# Altium schematic sheet MicroController.SchDoc
size A3; Revision: V1.0; SheetNumber: 2; SheetTotal: 3
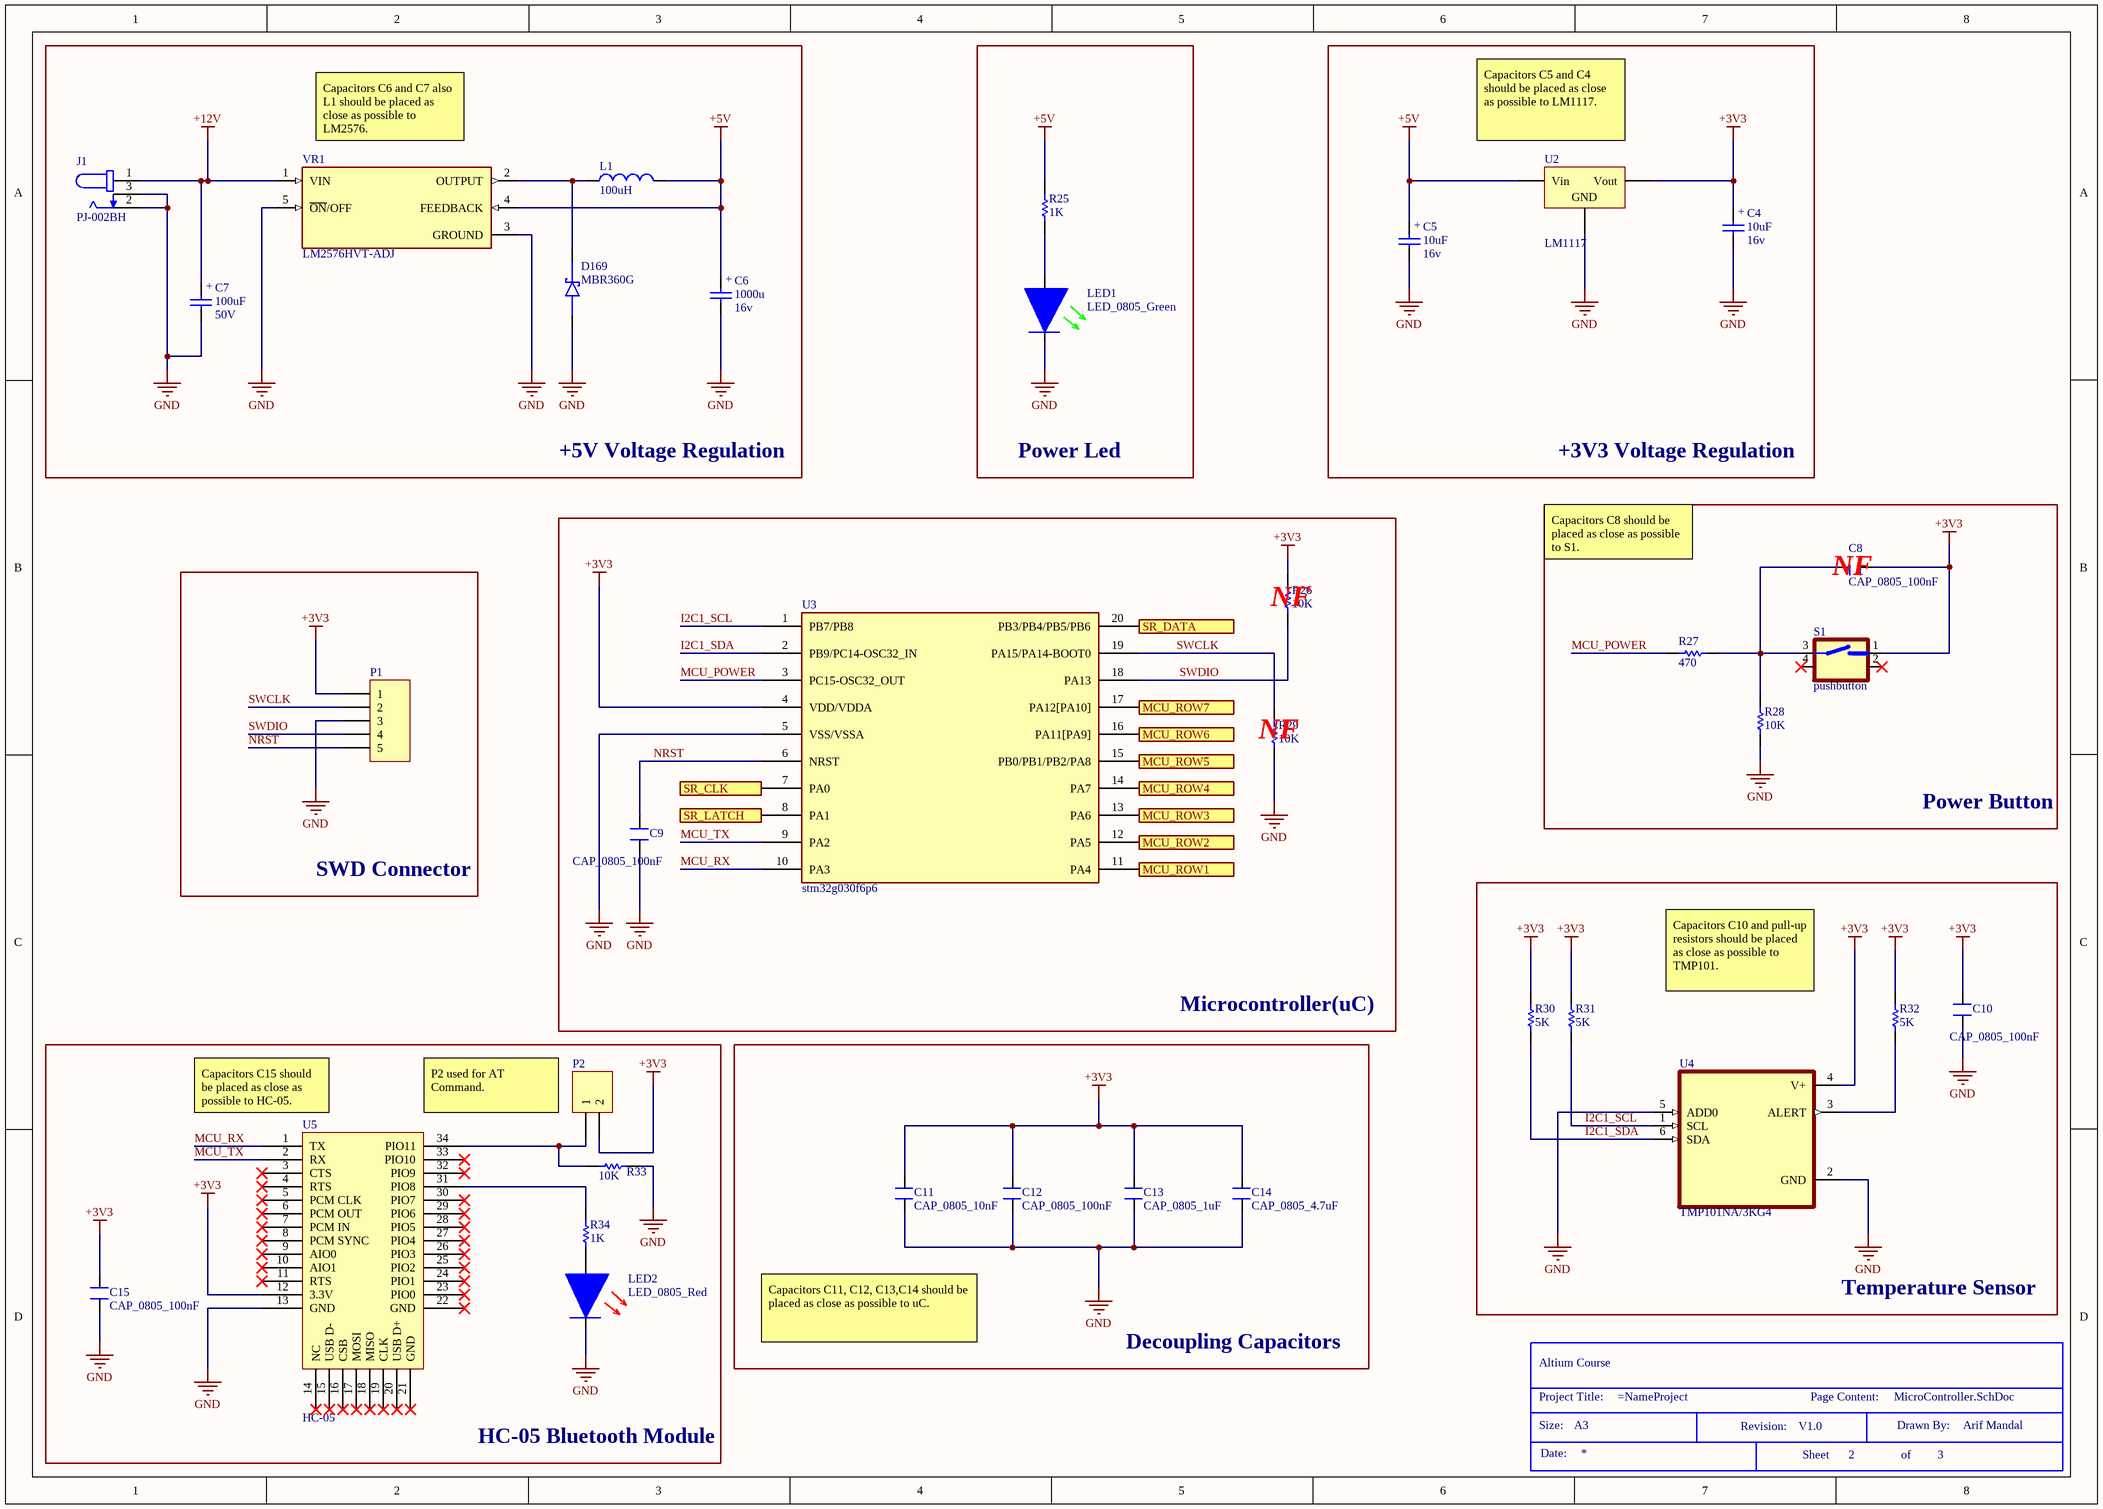
[diagram p0: MicroController.SchDoc]

## Parts
*  Size: A3  Drawn By: Arif Mandal  (hidden comment: Title Block)  (graphical)
C4  Volte: 16v  [MY_SMC_B]  (hidden comment: 10uF)
C5  Volte: 16v  [MY_SMC_B]  (hidden comment: 10uF)
C6  Volte: 16v  [MY_CLV_0810]  (hidden comment: 1000u)
C7  Volte: 50V  [MY_CLV_0810]  (hidden comment: 100uF)
C8  CAP_0805_100nF  [CAP_0805]
C9  CAP_0805_100nF  [CAP_0805]
C10  CAP_0805_100nF  [CAP_0805]
C11  CAP_0805_10nF  [CAP_0805]
C12  CAP_0805_100nF  [CAP_0805]
C13  CAP_0805_1uF  [CAP_0805]
C14  CAP_0805_4.7uF  [CAP_0805]
C15  CAP_0805_100nF  [CAP_0805]
D169  MBR360G  [DIOAD950W125L840D505]
J1  PJ-002BH  [CUI_PJ-002BH]
L1  100uH  [MY_DR125]
LED1  LED_0805_Green  [LED_0805]
LED2  LED_0805_Red  [LED_0805]
P1  Header 5  [My_1X05]  (value not drawn)
P2  Header 2  [My_1X02]  (value not drawn)
R25  1K  [MY_0805]
R26  10K  [MY_0805]
R27  470  [MY_0805]
R28  10K  [MY_0805]
R29  10K  [MY_0805]
R30  5K  [MY_0805]
R31  5K  [MY_0805]
R32  5K  [MY_0805]
R33  10K  [MY_0805]
R34  1K  [MY_0805]
S1  pushbutton  [button]
U2  LM1117  [MY_SOT223]
U3  stm32g030f6p6  [TSSOP20]
U4  TMP101NA/3KG4  [SOT95P280X145-6N]
U5  HC-05  [HC-05]
VR1  LM2576HVT-ADJ  [TO170P1067X483X1651-5]

## Blocks framed on the sheet
+5V Voltage Regulation: C6 C7 D169 J1 L1 VR1
Power Led: LED1 R25
+3V3 Voltage Regulation: C4 C5 U2
NF: C8 R27 R28 S1
SWD Connector: P1
Temperature Sensor: C10 R30-R32 U4
HC-05 Bluetooth Module: C15 LED2 P2 R33 R34 U5
Decoupling Capacitors: C11-C14

## Ports
MCU_ROW1 (out), MCU_ROW2 (out), MCU_ROW3 (out), MCU_ROW4 (out), MCU_ROW5 (out), MCU_ROW6 (out), MCU_ROW7 (out), SR_CLK (out), SR_DATA (out), SR_LATCH (out)

## Nets
+3V3: C4.+ C8.2 C10.2 C11.2 C12.2 C13.2 C14.2 C15.2 P1.1 P2.2 R26.1 R30.1 R31.1 R32.1 S1.1 U2.2(Vout) U3.4(VDD/VDDA) U4.4(V+) U5.12(3.3V)
+5V: C5.+ C6.+ L1.2 R25.2 U2.3(Vin) VR1.4(FEEDBACK)
+12V: C7.+ J1.1 VR1.1(VIN)
GND: C4.- C5.- C6.- C7.- C9.1 C10.1 C11.1 C12.1 C13.1 C14.1 C15.1 D169.A J1.2 J1.3 LED1.C LED2.C P1.3 R28.2 R29.2 R33.1 U2.1(GND) U3.5(VSS/VSSA) U4.2(GND) U4.5(ADD0) U5.13(GND) VR1.3(GROUND) VR1.5(~{ON}/OFF)
I2C1_SCL: R31.2 U3.1(PB7/PB8) U4.1(SCL)
I2C1_SDA: R30.2 U3.2(PB9/PC14-OSC32_IN) U4.6(SDA)
MCU_POWER: R27.1 U3.3(PC15-OSC32_OUT)
MCU_ROW1: U3.11(PA4) ; port MCU_ROW1
MCU_ROW2: U3.12(PA5) ; port MCU_ROW2
MCU_ROW3: U3.13(PA6) ; port MCU_ROW3
MCU_ROW4: U3.14(PA7) ; port MCU_ROW4
MCU_ROW5: U3.15(PB0/PB1/PB2/PA8) ; port MCU_ROW5
MCU_ROW6: U3.16(PA11[PA9]) ; port MCU_ROW6
MCU_ROW7: U3.17(PA12[PA10]) ; port MCU_ROW7
MCU_RX: U3.10(PA3) U5.1(TX)
MCU_TX: U3.9(PA2) U5.2(RX)
NRST: C9.2 P1.5 U3.6(NRST)
SR_CLK: U3.7(PA0) ; port SR_CLK
SR_DATA: U3.20(PB3/PB4/PB5/PB6) ; port SR_DATA
SR_LATCH: U3.8(PA1) ; port SR_LATCH
SWCLK: P1.2 R29.1 U3.19(PA15/PA14-BOOT0)
SWDIO: P1.4 R26.2 U3.18(PA13)
NetC8_1: C8.1 R27.2 R28.1 S1.3
NetD169_C: D169.C L1.1 VR1.2(OUTPUT)
NetLED1_A: LED1.A R25.1
NetLED2_A: LED2.A R34.1
NetP2_1: P2.1 R33.2 U5.34(PIO11)
NetR32_2: R32.2 U4.3(ALERT)
NetR34_2: R34.2 U5.31(PIO8)

Not connected (* = marked no-connect by the designer): S1 2* 4(1)*; U5 3(CTS)* 4(RTS)* 5(PCM_CLK)* 6(PCM_OUT)* 7(PCM_IN)* 8(PCM_SYNC)* 9(AIO0)* 10(AIO1)* 11(RTS)* 14(NC)* 15(USB_D-)* 16(CSB)* 17(MOSI)* 18(MISO)* 19(CLK)* 20(USB_D+)* 21(GND)* 22(GND)* 23(PIO0)* 24(PIO1)* 25(PIO2)* 26(PIO3)* 27(PIO4)* 28(PIO5)* 29(PIO6)* 30(PIO7)* 32(PIO9)* 33(PIO10)*

## Notes on the sheet
- (near VR1) Capacitors C6 and C7 also L1 should be placed as close as possible to LM2576.
- (near U2) Capacitors C5 and C4 should be placed as close as possible to LM1117.
- Capacitors C8 should be placed as close as possible to S1.
- (near R26) NF
- (near R29) NF
- Power Button
- Capacitors C10 and pull-up resistors should be placed as close as possible to TMP101.
- Microcontroller(uC)
- (near U5) Capacitors C15 should be placed as close as possible to HC-05.
- P2 used for AT Command.
- Capacitors C11, C12, C13,C14 should be placed as close as possible to uC.
- (in symbol Title Block) Altium Course; Project Title:; Page Content:; Size:; Revision:; Drawn By:; Date:; Sheet; of

## Library data of the parts
C4-C7 = Cap Pol: Polar capacitor; ASiD Part Number: C-AS
  C4 C5: Value: 10uF
  C6: Value: 1000u
  C7: Value: 100uF
C8-C10 C12 C15 = CAP_0805_100nF: 0805 100nF 16VDC ±10% X7R; Voltage Rating: 16V; Tolerance: %10; Package Size: 0805; Manufacturer: https://ozdisan.com/pasif-komponentler/kapasitorler/smt-smd-ve-mlcc-kapasitorler/CC0805KRX7R7BB104/748339; Dielectric: X7R
C11 = CAP_0805_10nF: 0805 10nF 16VDC ±10% X7R; Voltage Rating: 16V; Tolerance: %10; Package Size: 0805; Manufacturer: https://ozdisan.com/pasif-komponentler/kapasitorler/smt-smd-ve-mlcc-kapasitorler/CL21B105KOFNNNE/29632; Dielectric: X7R
C13 = CAP_0805_1uF: 0805 1uF 16VDC ±10% X7R; Voltage Rating: 16V; Tolerance: %10; Package Size: 0805; Manufacturer: https://ozdisan.com/pasif-komponentler/kapasitorler/smt-smd-ve-mlcc-kapasitorler/CL21B105KOFNNNE/29632; Dielectric: X7R
C14 = CAP_0805_4.7uF: 0805 4.7uF 16VDC ±10% X7R; Voltage Rating: 16V; Tolerance: %10; Package Size: 0805; Manufacturer: https://ozdisan.com/pasif-komponentler/kapasitorler/smt-smd-ve-mlcc-kapasitorler/CL21B105KOFNNNE/29632; Dielectric: X7R
D169 = MBR360G: Diode Schottky 60V 3A Through Hole DO-201AD; MF: ON Semiconductor; Check_prices: https://www.snapeda.com/parts/MBR360G/ON%20Semiconductor/view-part/53063/?ref=eda; Value: *; Price: None; Availability: Good; Package: AXIAL LEAD-2 ON Semiconductor; MP: MBR360G; Purchase-URL: https://pricing.snapeda.com/search/part/MBR360G/?ref=eda; SnapEDA_Link: https://www.snapeda.com/parts/MBR360G/ON%20Semiconductor/view-part/53063/?ref=snap
J1 = PJ-002BH: 2.5 x 6.5 mm, 5.0 A, Horizontal, Through Hole, Dc Power Jack Connector; MF: CUI Devices; CUI_purchase_URL: https://www.cuidevices.com/product/interconnect/connectors/dc-power-connectors/jacks/pj-002bh?utm_source=snapeda.com&utm_medium=referral&utm_campaign=snapedaBOM; Purchase-URL: https://pricing.snapeda.com/search/part/PJ-002BH/?ref=eda; MP: PJ-002BH; SnapEDA_Link: https://www.snapeda.com/parts/PJ-002BH/CUI+Devices/view-part/?ref=snap; Price: None; Package: None; Check_prices: https://www.snapeda.com/parts/PJ-002BH/CUI+Devices/view-part/?ref=eda; Value: *; Availability: In Stock
L1 = Inductor: ASiD Part Number: Inductor-AS; Current: 1A; Value: 100uH
LED1 = LED_0805_Green: LED SMD 0805 GREEN 550mcd; Voltage Rating: 2.6; Current: 20mA; Package Size: 0805; Manufacturer: https://ozdisan.com/led-ve-aydinlatma-cozumleri/led-komponentler/sinyal-ledler-tek-renkli/HL-PSC-2012U51GC/471651
LED2 = LED_0805_Red: LED SMD 0805 RED 550mcd; Voltage Rating: 2.6; Current: 20mA; Package Size: 0805; Manufacturer: https://ozdisan.com/led-ve-aydinlatma-cozumleri/led-komponentler/sinyal-ledler-tek-renkli/HL-PSC-2012U51GC/471651
P1 = Header 5: Header, 5-Pin; ASiD Part Number: Header 5-AS
P2 = Header 2: Header, 2-Pin; ASiD Part Number: Header 2-AS
R25-R34 = Res: Standard resistor; ASiD Part Number: Res-AS
  R25 R34: Value: 1K
  R26 R28 R29 R33: Value: 10K
  R27: Value: 470
  R30-R32: Value: 5K
U2 = LM1117: Low Drop Voltage Reg; ASiD Part Number: LM1117-AS
U3 = stm32g030f6p6: ARM® Cortex®-M0+ STM32G0 Microcontroller IC 32-Bit Single-Core 64MHz 32KB (32K x 8) FLASH 20-TSSOP
VR1 = LM2576HVT-ADJ: SIMPLE SWITCHER&reg; 4V to 60V, 3A Low Component Count Step-Down Regulator 5-TO-220 -40 to 125; MF: Texas Instruments; SnapEDA_Link: https://www.snapeda.com/parts/LM2576HVT-ADJ/Texas+Instruments/view-part/?ref=snap; Package: TO-220-5 Texas Instruments; MP: LM2576HVT-ADJ; Check_prices: https://www.snapeda.com/parts/LM2576HVT-ADJ/Texas+Instruments/view-part/?ref=eda; Purchase-URL: https://pricing.snapeda.com/search/part/LM2576HVT-ADJ/?ref=eda; Price: None; Value: *; Availability: In Stock
U4 = TMP101NA/3KG4: Package: None; Price: None; Value: *; MP: TMP101NA/3KG4; Availability: Unavailable